# Altium schematic sheet Sheet2.SchDoc
size A4; SheetNumber: 1; SheetTotal: 2
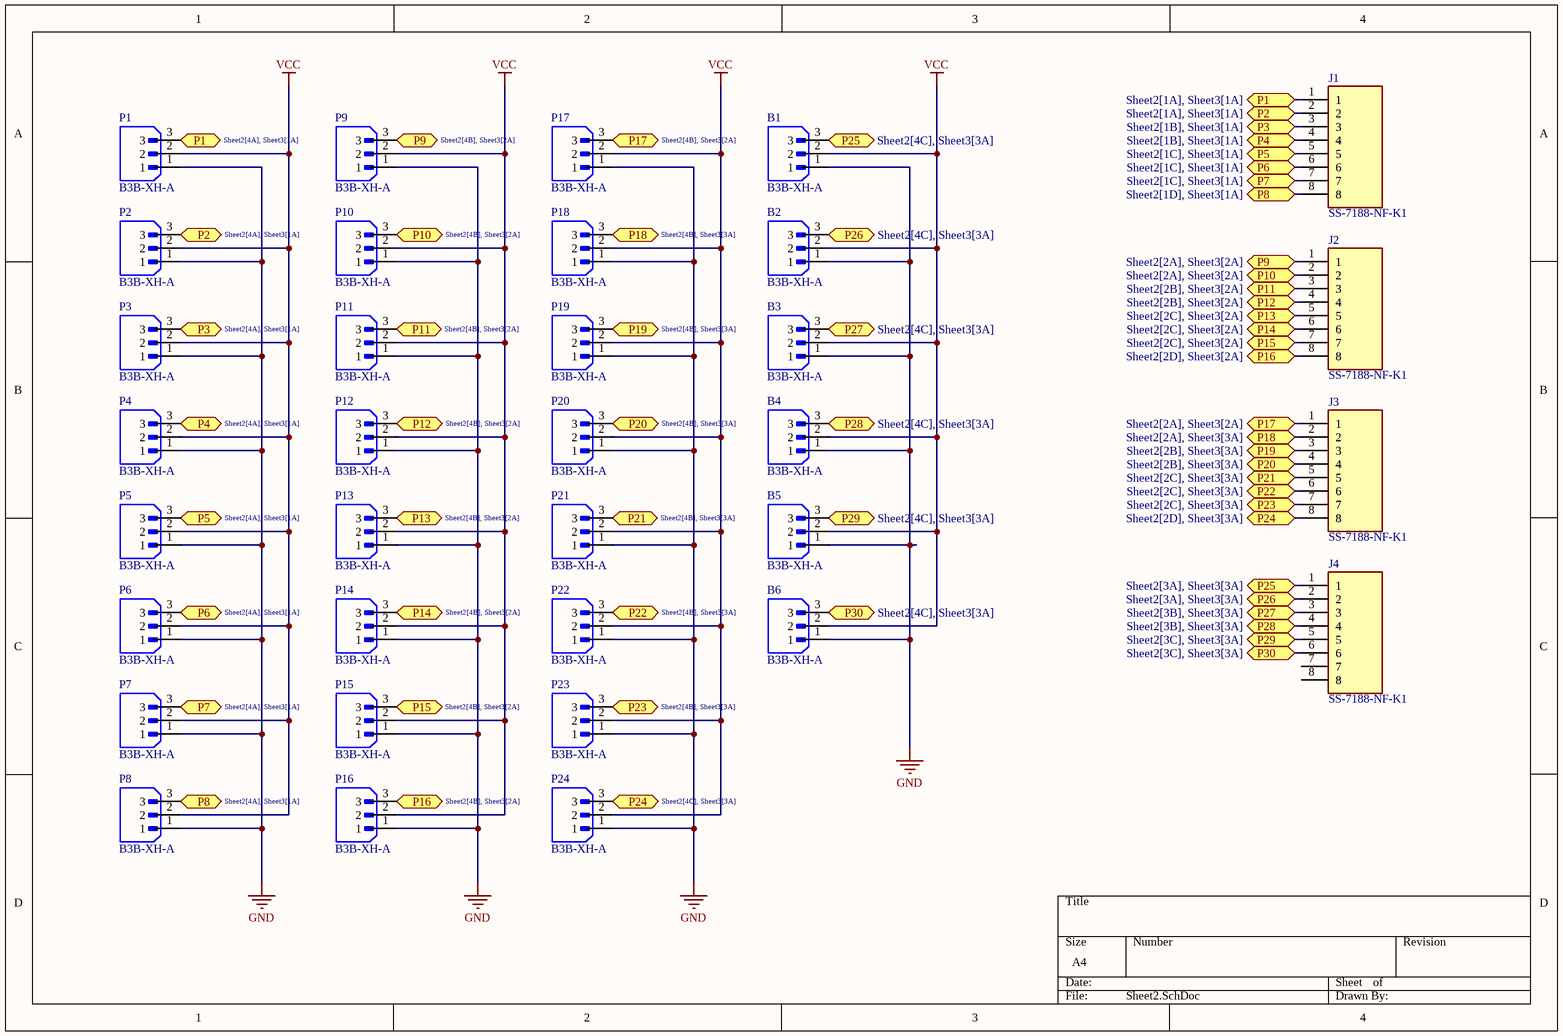
[diagram p0: Sheet2.SchDoc]

## Parts
B1  B3B-XH-A  [JST_B3B-XH-A]
B2  B3B-XH-A  [JST_B3B-XH-A]
B3  B3B-XH-A  [JST_B3B-XH-A]
B4  B3B-XH-A  [JST_B3B-XH-A]
B5  B3B-XH-A  [JST_B3B-XH-A]
B6  B3B-XH-A  [JST_B3B-XH-A]
J1  SS-7188-NF-K1  [BEL_SS-7188-NF-K1]
J2  SS-7188-NF-K1  [BEL_SS-7188-NF-K1]
J3  SS-7188-NF-K1  [BEL_SS-7188-NF-K1]
J4  SS-7188-NF-K1  [BEL_SS-7188-NF-K1]
P1  B3B-XH-A  [JST_B3B-XH-A]
P2  B3B-XH-A  [JST_B3B-XH-A]
P3  B3B-XH-A  [JST_B3B-XH-A]
P4  B3B-XH-A  [JST_B3B-XH-A]
P5  B3B-XH-A  [JST_B3B-XH-A]
P6  B3B-XH-A  [JST_B3B-XH-A]
P7  B3B-XH-A  [JST_B3B-XH-A]
P8  B3B-XH-A  [JST_B3B-XH-A]
P9  B3B-XH-A  [JST_B3B-XH-A]
P10  B3B-XH-A  [JST_B3B-XH-A]
P11  B3B-XH-A  [JST_B3B-XH-A]
P12  B3B-XH-A  [JST_B3B-XH-A]
P13  B3B-XH-A  [JST_B3B-XH-A]
P14  B3B-XH-A  [JST_B3B-XH-A]
P15  B3B-XH-A  [JST_B3B-XH-A]
P16  B3B-XH-A  [JST_B3B-XH-A]
P17  B3B-XH-A  [JST_B3B-XH-A]
P18  B3B-XH-A  [JST_B3B-XH-A]
P19  B3B-XH-A  [JST_B3B-XH-A]
P20  B3B-XH-A  [JST_B3B-XH-A]
P21  B3B-XH-A  [JST_B3B-XH-A]
P22  B3B-XH-A  [JST_B3B-XH-A]
P23  B3B-XH-A  [JST_B3B-XH-A]
P24  B3B-XH-A  [JST_B3B-XH-A]

## Ports
P1 (bidir, see Sheet2[1A], Sheet3[1A]), P1 (bidir, see Sheet2[4A], Sheet3[1A]), P2 (bidir, see Sheet2[1A], Sheet3[1A]), P2 (bidir, see Sheet2[4A], Sheet3[1A]), P3 (bidir, see Sheet2[1B], Sheet3[1A]), P3 (bidir, see Sheet2[4A], Sheet3[1A]), P4 (bidir, see Sheet2[1B], Sheet3[1A]), P4 (bidir, see Sheet2[4A], Sheet3[1A]), P5 (bidir, see Sheet2[1C], Sheet3[1A]), P5 (bidir, see Sheet2[4A], Sheet3[1A]), P6 (bidir, see Sheet2[1C], Sheet3[1A]), P6 (bidir, see Sheet2[4A], Sheet3[1A]), P7 (bidir, see Sheet2[1C], Sheet3[1A]), P7 (bidir, see Sheet2[4A], Sheet3[1A]), P8 (bidir, see Sheet2[1D], Sheet3[1A]), P8 (bidir, see Sheet2[4A], Sheet3[1A]), P9 (bidir, see Sheet2[2A], Sheet3[2A]), P9 (bidir, see Sheet2[4B], Sheet3[2A]), P10 (bidir, see Sheet2[2A], Sheet3[2A]), P10 (bidir, see Sheet2[4B], Sheet3[2A]), P11 (bidir, see Sheet2[2B], Sheet3[2A]), P11 (bidir, see Sheet2[4B], Sheet3[2A]), P12 (bidir, see Sheet2[2B], Sheet3[2A]), P12 (bidir, see Sheet2[4B], Sheet3[2A]), P13 (bidir, see Sheet2[2C], Sheet3[2A]), P13 (bidir, see Sheet2[4B], Sheet3[2A]), P14 (bidir, see Sheet2[2C], Sheet3[2A]), P14 (bidir, see Sheet2[4B], Sheet3[2A]), P15 (bidir, see Sheet2[2C], Sheet3[2A]), P15 (bidir, see Sheet2[4B], Sheet3[2A]), P16 (bidir, see Sheet2[2D], Sheet3[2A]), P16 (bidir, see Sheet2[4B], Sheet3[2A]), P17 (bidir, see Sheet2[2A], Sheet3[2A]), P17 (bidir, see Sheet2[4B], Sheet3[2A]), P18 (bidir, see Sheet2[2A], Sheet3[3A]), P18 (bidir, see Sheet2[4B], Sheet3[3A]), P19 (bidir, see Sheet2[2B], Sheet3[3A]), P19 (bidir, see Sheet2[4B], Sheet3[3A]), P20 (bidir, see Sheet2[2B], Sheet3[3A]), P20 (bidir, see Sheet2[4B], Sheet3[3A]), P21 (bidir, see Sheet2[2C], Sheet3[3A]), P21 (bidir, see Sheet2[4B], Sheet3[3A]), P22 (bidir, see Sheet2[2C], Sheet3[3A]), P22 (bidir, see Sheet2[4B], Sheet3[3A]), P23 (bidir, see Sheet2[2C], Sheet3[3A]), P23 (bidir, see Sheet2[4B], Sheet3[3A]), P24 (bidir, see Sheet2[2D], Sheet3[3A]), P24 (bidir, see Sheet2[4C], Sheet3[3A]), P25 (bidir, see Sheet2[3A], Sheet3[3A]), P25 (bidir, see Sheet2[4C], Sheet3[3A]), P26 (bidir, see Sheet2[3A], Sheet3[3A]), P26 (bidir, see Sheet2[4C], Sheet3[3A]), P27 (bidir, see Sheet2[3B], Sheet3[3A]), P27 (bidir, see Sheet2[4C], Sheet3[3A]), P28 (bidir, see Sheet2[3B], Sheet3[3A]), P28 (bidir, see Sheet2[4C], Sheet3[3A]), P29 (bidir, see Sheet2[3C], Sheet3[3A]), P29 (bidir, see Sheet2[4C], Sheet3[3A]), P30 (bidir, see Sheet2[3C], Sheet3[3A]), P30 (bidir, see Sheet2[4C], Sheet3[3A])

## Nets
GND: B1.1 B2.1 B3.1 B4.1 B5.1 B6.1 P1.1 P2.1 P3.1 P4.1 P5.1 P6.1 P7.1 P8.1 P9.1 P10.1 P11.1 P12.1 P13.1 P14.1 P15.1 P16.1 P17.1 P18.1 P19.1 P20.1 P21.1 P22.1 P23.1 P24.1
VCC: B1.2 B2.2 B3.2 B4.2 B5.2 B6.2 P1.2 P2.2 P3.2 P4.2 P5.2 P6.2 P7.2 P8.2 P9.2 P10.2 P11.2 P12.2 P13.2 P14.2 P15.2 P16.2 P17.2 P18.2 P19.2 P20.2 P21.2 P22.2 P23.2 P24.2
P1: J1.1 P1.3 ; port P1
P2: J1.2 P2.3 ; port P2
P3: J1.3 P3.3 ; port P3
P4: J1.4 P4.3 ; port P4
P5: J1.5 P5.3 ; port P5
P6: J1.6 P6.3 ; port P6
P7: J1.7 P7.3 ; port P7
P8: J1.8 P8.3 ; port P8
P9: J2.1 P9.3 ; port P9
P10: J2.2 P10.3 ; port P10
P11: J2.3 P11.3 ; port P11
P12: J2.4 P12.3 ; port P12
P13: J2.5 P13.3 ; port P13
P14: J2.6 P14.3 ; port P14
P15: J2.7 P15.3 ; port P15
P16: J2.8 P16.3 ; port P16
P17: J3.1 P17.3 ; port P17
P18: J3.2 P18.3 ; port P18
P19: J3.3 P19.3 ; port P19
P20: J3.4 P20.3 ; port P20
P21: J3.5 P21.3 ; port P21
P22: J3.6 P22.3 ; port P22
P23: J3.7 P23.3 ; port P23
P24: J3.8 P24.3 ; port P24
P25: B1.3 J4.1 ; port P25
P26: B2.3 J4.2 ; port P26
P27: B3.3 J4.3 ; port P27
P28: B4.3 J4.4 ; port P28
P29: B5.3 J4.5 ; port P29
P30: B6.3 J4.6 ; port P30

Not connected (* = marked no-connect by the designer): J4 7 8

## Library data of the parts
B1-B6 P1-P24 = B3B-XH-A: Connector Header Through Hole 3 position 0.098 (2.50mm); MF: JST Sales; SnapEDA_Link: https://www.snapeda.com/parts/B3B-XH-A/JST+Sales+America+Inc./view-part/?ref=snap; Package: None; Value: *; MP: B3B-XH-A; Check_prices: https://www.snapeda.com/parts/B3B-XH-A/JST+Sales+America+Inc./view-part/?ref=eda
J1-J4 = SS-7188-NF-K1: Conn Modular Jack F 8 POS 2.54mm Solder RA Thru-Hole 8 Terminal 1 Port Cat 5; Package: None; Price: None; Value: *; MP: SS-7188-NF-K1; Availability: Unavailable